# EAGLE design powerdist2 (EAGLE 6.5.0)
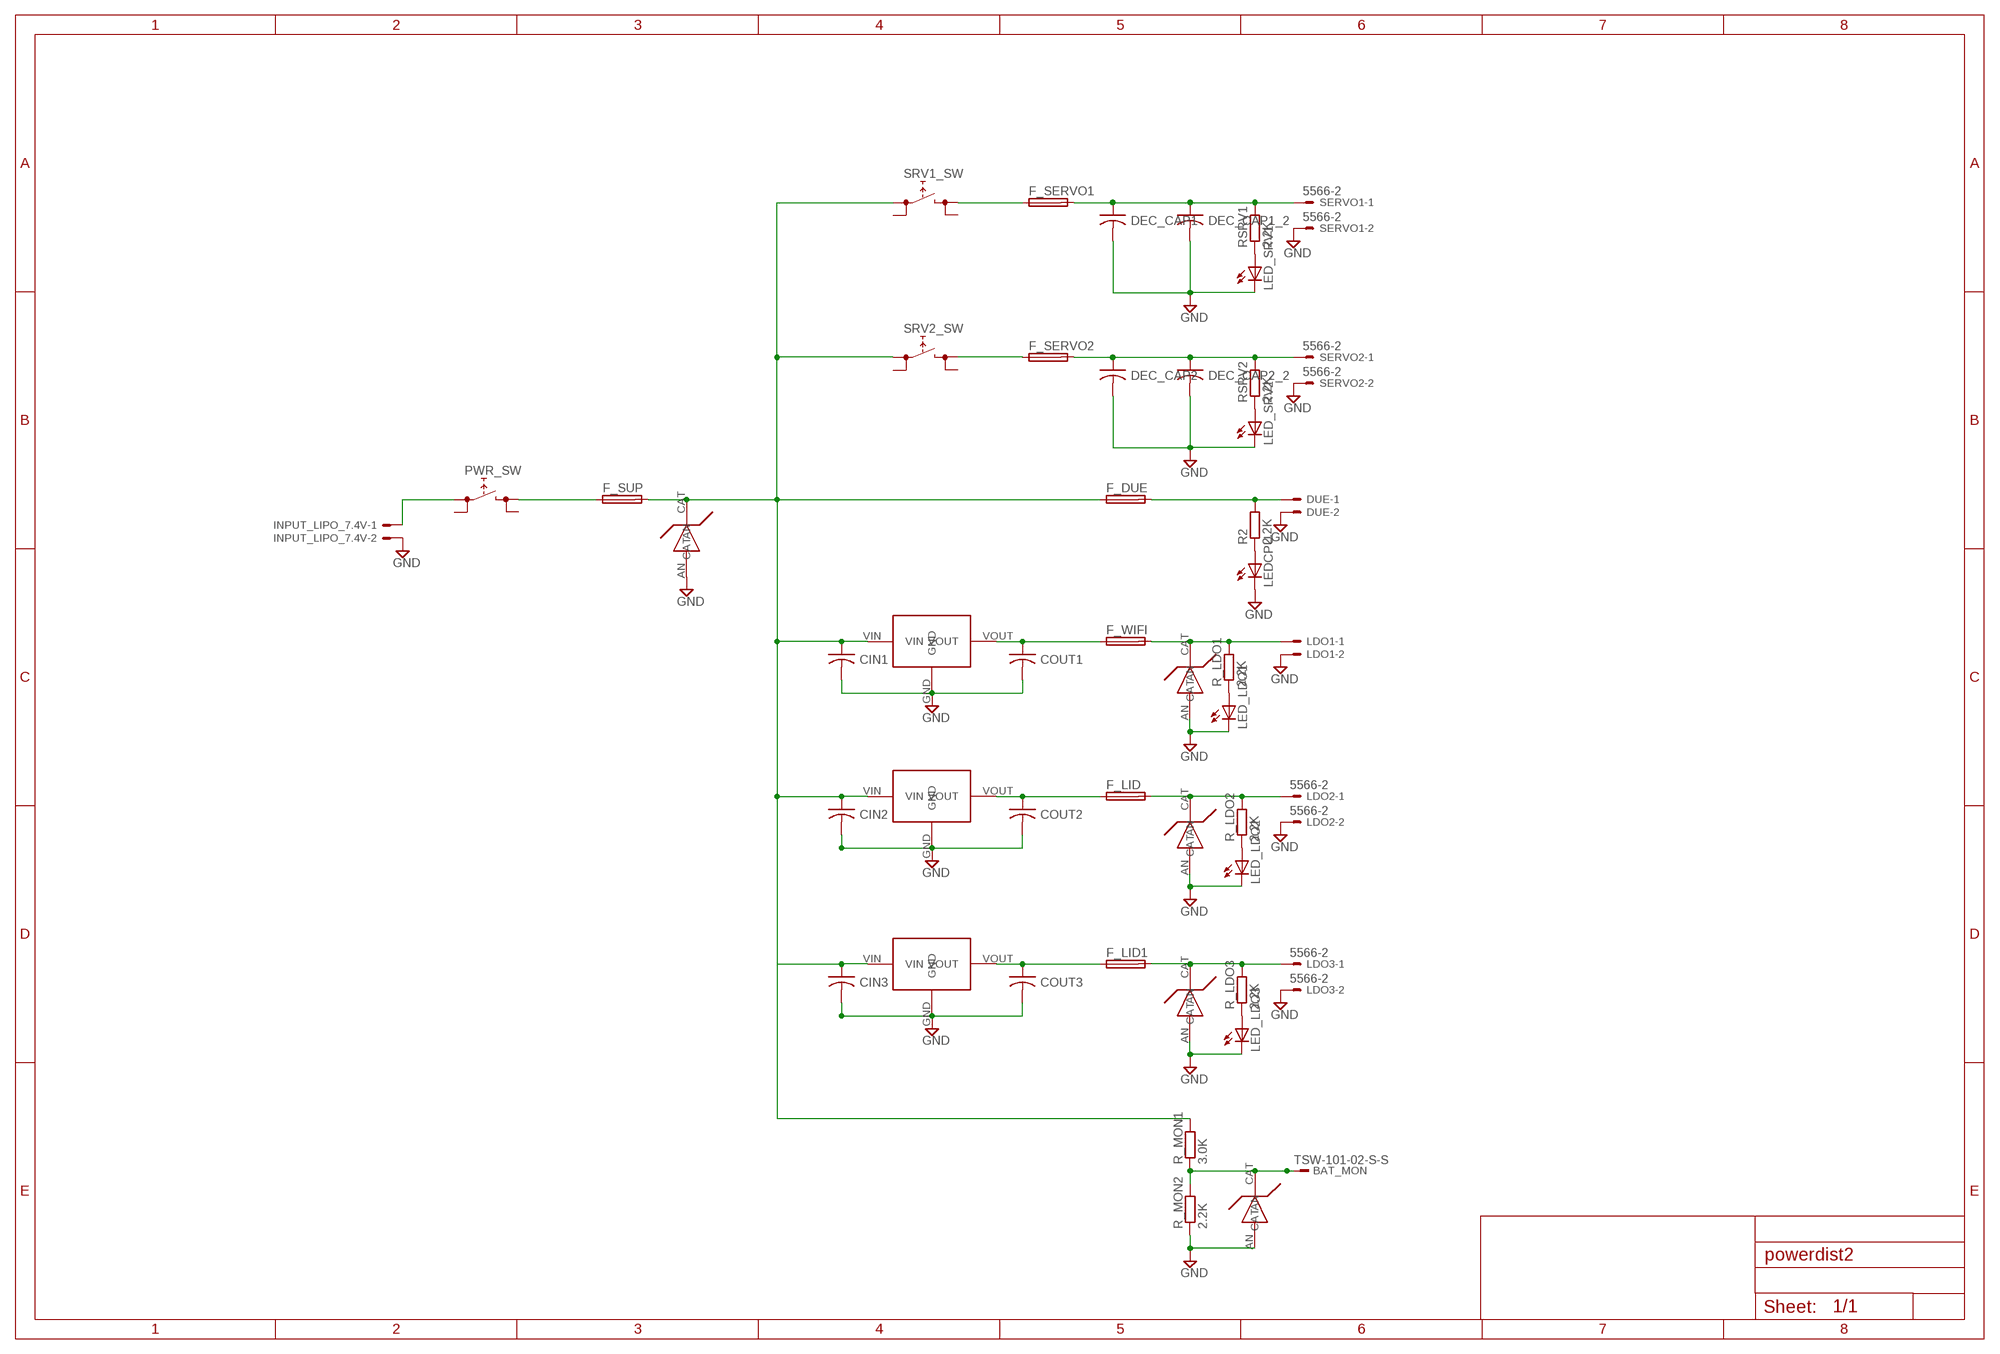
[diagram p0: schematic, sheet 1]

## Parts
BAT_MON  TSW-101-02-S-S  [TSW-101-02-S-S]
CIN1  CAPACITORTH_CAP  [C025-025X050]
CIN2  CAPACITORTH_CAP  [C025-025X050]
CIN3  CAPACITORTH_CAP  [C025-025X050]
COUT1  CAPACITORTH_CAP  [C025-025X050]
COUT2  CAPACITORTH_CAP  [C025-025X050]
COUT3  CAPACITORTH_CAP  [C025-025X050]
DEC_CAP1  CAPACITORTH_CAP  [C025-025X050]
DEC_CAP1_2  CAPACITORTH_CAP  [C025-025X050]
DEC_CAP2  CAPACITORTH_CAP  [C025-025X050]
DEC_CAP2_2  CAPACITORTH_CAP  [C025-025X050]
DUE  C-GRID-02-70553  [70553-02]
F_DUE  GSH15  [GSH15]
F_LID  GSH15  [GSH15]
F_LID1  GSH15  [GSH15]
F_SERVO1  GSH15  [GSH15]
F_SERVO2  GSH15  [GSH15]
F_SUP  GSH15  [GSH15]
F_WIFI  GSH15  [GSH15]
INPUT_LIPO_7.4V  22-23-2021  [22-23-2021]
LDO1  C-GRID-02-70553  [70553-02]
LDO2  5566-2  [5566-2]
LDO3  5566-2  [5566-2]
LED_LDO1  LEDCHIP-LED0805  [CHIP-LED0805]
LED_LDO2  LEDCHIP-LED0805  [CHIP-LED0805]
LED_LDO3  LEDCHIP-LED0805  [CHIP-LED0805]
LED_SRV1  LEDCHIP-LED0805  [CHIP-LED0805]
LED_SRV2  LEDCHIP-LED0805  [CHIP-LED0805]
LEDCPU  LEDCHIP-LED0805  [CHIP-LED0805]
LID12V1A  MIC29150/29300/29500  [MIC29150/29300/29500]
LID12V1A1  MIC29150/29300/29500  [MIC29150/29300/29500]
PWR_SW  REKN  [REKN]
R2  2.2K  R-EU_R0402  [R0402]
R_LDO1  2.2K  R-EU_R0402  [R0402]
R_LDO2  2.2K  R-EU_R0402  [R0402]
R_LDO3  2.2K  R-EU_R0402  [R0402]
R_MON1  3.0K  R-EU_R0402  [R0402]
R_MON2  2.2K  R-EU_R0402  [R0402]
RSRV1  2.2K  R-EU_R0402  [R0402]
RSRV2  2.2K  R-EU_R0402  [R0402]
SERVO1  5566-2  [5566-2]
SERVO2  5566-2  [5566-2]
SRV1_SW  REKN  [REKN]
SRV2_SW  REKN  [REKN]
TVS-MAIN  26V  TVS-DIODE-SMAJ  [TVS-SMAJ]
TVS-MAIN1  16V  TVS-DIODE-SMAJ  [TVS-SMAJ]
TVS-MAIN2  5V  TVS-DIODE-SMAJ  [TVS-SMAJ]
TVS-MAIN3  16V  TVS-DIODE-SMAJ  [TVS-SMAJ]
TVS_3.3  16V  TVS-DIODE-SMAJ  [TVS-SMAJ]
WIFI5V1A1  MIC29150/29300/29500  [MIC29150/29300/29500]

## Nets
GND: CIN1.2 CIN2.2 CIN3.2 COUT1.2 COUT2.2 COUT3.2 DEC_CAP1.2 DEC_CAP1_2.2 DEC_CAP2.2 DEC_CAP2_2.2 DUE.2 INPUT_LIPO_7.4V.2 LDO1.2 LDO2.2 LDO3.2 LED_LDO1.C LED_LDO2.C LED_LDO3.C LED_SRV1.C LED_SRV2.C LEDCPU.C LID12V1A1.GND LID12V1A.GND R_MON2.1 SERVO1.2 SERVO2.2 TVS-MAIN1.AN TVS-MAIN2.AN TVS-MAIN3.AN TVS-MAIN.AN TVS_3.3.AN WIFI5V1A1.GND
N$1: DEC_CAP2.1 DEC_CAP2_2.1 F_SERVO2.2 RSRV2.2 SERVO2.1
N$2: F_LID.2 LDO2.1 R_LDO2.2 TVS-MAIN3.CAT
N$3: F_SERVO1.1 SRV1_SW.1A
N$4: DUE.1 F_DUE.2 R2.2
N$5: LED_SRV2.A RSRV2.1
N$6: COUT1.1 F_WIFI.1 WIFI5V1A1.VOUT
N$7: F_WIFI.2 LDO1.1 R_LDO1.2 TVS-MAIN2.CAT
N$8: LEDCPU.A R2.1
N$9: COUT2.1 F_LID.1 LID12V1A.VOUT
N$10: INPUT_LIPO_7.4V.1 PWR_SW.0A
N$11: LED_LDO1.A R_LDO1.1
N$12: CIN1.1 CIN2.1 F_DUE.1 F_SUP.2 LID12V1A.VIN R_MON1.2 SRV1_SW.0A SRV2_SW.0A TVS-MAIN.CAT WIFI5V1A1.VIN
N$13: LED_LDO2.A R_LDO2.1
N$14: F_SUP.1 PWR_SW.1A
N$15: DEC_CAP1.1 DEC_CAP1_2.1 F_SERVO1.2 RSRV1.2 SERVO1.1
N$16: LED_SRV1.A RSRV1.1
N$17: F_SERVO2.1 SRV2_SW.1A
N$18: BAT_MON.1 R_MON1.1 R_MON2.2 TVS_3.3.CAT
N$19: COUT3.1 F_LID1.1 LID12V1A1.VOUT
N$20: CIN3.1 LID12V1A1.VIN
N$21: F_LID1.2 LDO3.1 R_LDO3.2 TVS-MAIN1.CAT
N$22: LED_LDO3.A R_LDO3.1
Unconnected: PWR_SW.0B PWR_SW.1B SRV1_SW.0B SRV1_SW.1B SRV2_SW.0B SRV2_SW.1B

## Library data of the parts
BAT_MON = con-samtec:TSW-101-02-S-S: THROUGH-HOLE .025" SQ POST HEADER Source: Samtec TSW.pdf; OC_FARNELL: unknown; OC_NEWARK: unknown
CIN1-CIN3 COUT1-COUT3 DEC_CAP1 DEC_CAP1_2 DEC_CAP2 DEC_CAP2_2 = TinyGadget(1):CAPACITOR
DUE LDO1 = con-molex:C-GRID-02: CONNECTOR wire to board 2.54 mm (0.100") pitch header; OC_FARNELL: unknown; OC_NEWARK: unknown
F_DUE F_LID F_LID1 F_SERVO1 F_SERVO2 F_SUP F_WIFI = fuse:GSH15: FUSE HOLDER grid 15mm, 19649 Wickmann; MPN: 64900001039; OC_FARNELL: 1271673; OC_NEWARK: 02P0318
INPUT_LIPO_7.4V = con-molex:22-23-2021: .100" (2.54mm) Center Header - 2 Pin; MF: MOLEX; MPN: 22-23-2021; OC_FARNELL: 1462926; OC_NEWARK: 25C3832
LDO2 LDO3 SERVO1 SERVO2 = con-molex:5566-2: Mini FIT connector 2 pol Source: http://www.molex.com; OC_FARNELL: 1822072; OC_NEWARK: unknown
LED_LDO1-LED_LDO3 LED_SRV1 LED_SRV2 LEDCPU = led:LED: LED OSRAM: - CHIPLED LG R971, LG N971, LY N971, LG Q971, LY Q971, LO R971, LY R971 LH N974, LH R974 LS Q976, LO Q976, LY Q976 LO Q996 - Hyper CHIPLED LW Q18S LB Q993, LB Q99A, LB R99A - SideLED LS A670, LO A670, LY A670, LG A670, LP A670 LB A673, LV A673, LT A673, LW A673 LH A674 LY A675 LS A676, LA A676, LO A676, LY A676, LW A676 LS A679, LY A679, LG A679 - Hyper Micro SIDELED® LS Y876, LA Y876, LO Y876, LY Y876 LT Y87S - SmartLED LW L88C, LW L88S LB L89C, LB L89S, LG L890 LS L89K, LO L89K, LY L89K LS L896, LA L896, LO L896, LY L896 - TOPLED LS T670, LO T670, LY T670, LG T670, LP T670 LSG T670, LSP T670, LSY T670, LOP T670, LYG T670 LG T671, LOG T671, LSG T671 LB T673, LV T673, LT T673, LW T673 LH T674 LS T676, LA T676, LO T676, LY T676, LB T676, LH T676, LSB T676, LW T676 LB T67C, LV T67C, LT T67C, LS T67K, LO T67K, LY T67K, LW E67C LS E67B, LA E67B, LO E67B, LY E67B, LB E67C, LV E67C, LT E67C LW T67C LS T679, LY T679, LG T679 LS T770, LO T770, LY T770, LG T770, LP T770 LB T773, LV T773, LT T773, LW T773 LH T774 LS E675, LA E675, LY E675, LS T675 LS T776, LA T776, LO T776, LY T776, LB T776 LHGB T686 LT T68C, LB T68C - Hyper Mini TOPLED® LB M676 - Mini TOPLED Santana® LG M470 LS M47K, LO M47K, LY M47K Source: http://www.osram.convergy.de LUXEON: - LUMILED® LXK2-PW12-R00, LXK2-PW12-S00, LXK2-PW14-U00, LXK2-PW14-V00 LXK2-PM12-R00, LXK2-PM12-S00, LXK2-PM14-U00 LXK2-PE12-Q00, LXK2-PE12-R00, LXK2-PE12-S00, LXK2-PE14-T00, LXK2-PE14-U00 LXK2-PB12-K00, LXK2-PB12-L00, LXK2-PB12-M00, LXK2-PB14-N00, LXK2-PB14-P00, LXK2-PB14-Q00 LXK2-PR12-L00, LXK2-PR12-M00, LXK2-PR14-Q00, LXK2-PR14-R00 LXK2-PD12-Q00, LXK2-PD12-R00, LXK2-PD12-S00 LXK2-PH12-R00, LXK2-PH12-S00 LXK2-PL12-P00, LXK2-PL12-Q00, LXK2-PL12-R00 Source: www.luxeon.com KINGBRIGHT: KA-3528ASYC Source: www.kingbright.com
LID12V1A LID12V1A1 WIFI5V1A1 = Micrel-Voltage-Regulator:MIC29150/29300/29500
PWR_SW SRV1_SW SRV2_SW = switch:REKN: PUSH SWITCH ITT-Cannon-Cannon
R2 R_LDO1-R_LDO3 R_MON1 R_MON2 RSRV1 RSRV2 = resistor:R-EU_: RESISTOR, European symbol
TVS-MAIN TVS-MAIN1-TVS-MAIN3 TVS_3.3 = Micrel-Voltage-Regulator:TVS-DIODE-SMAJ: TVS Diode SMAJ Series

## Board
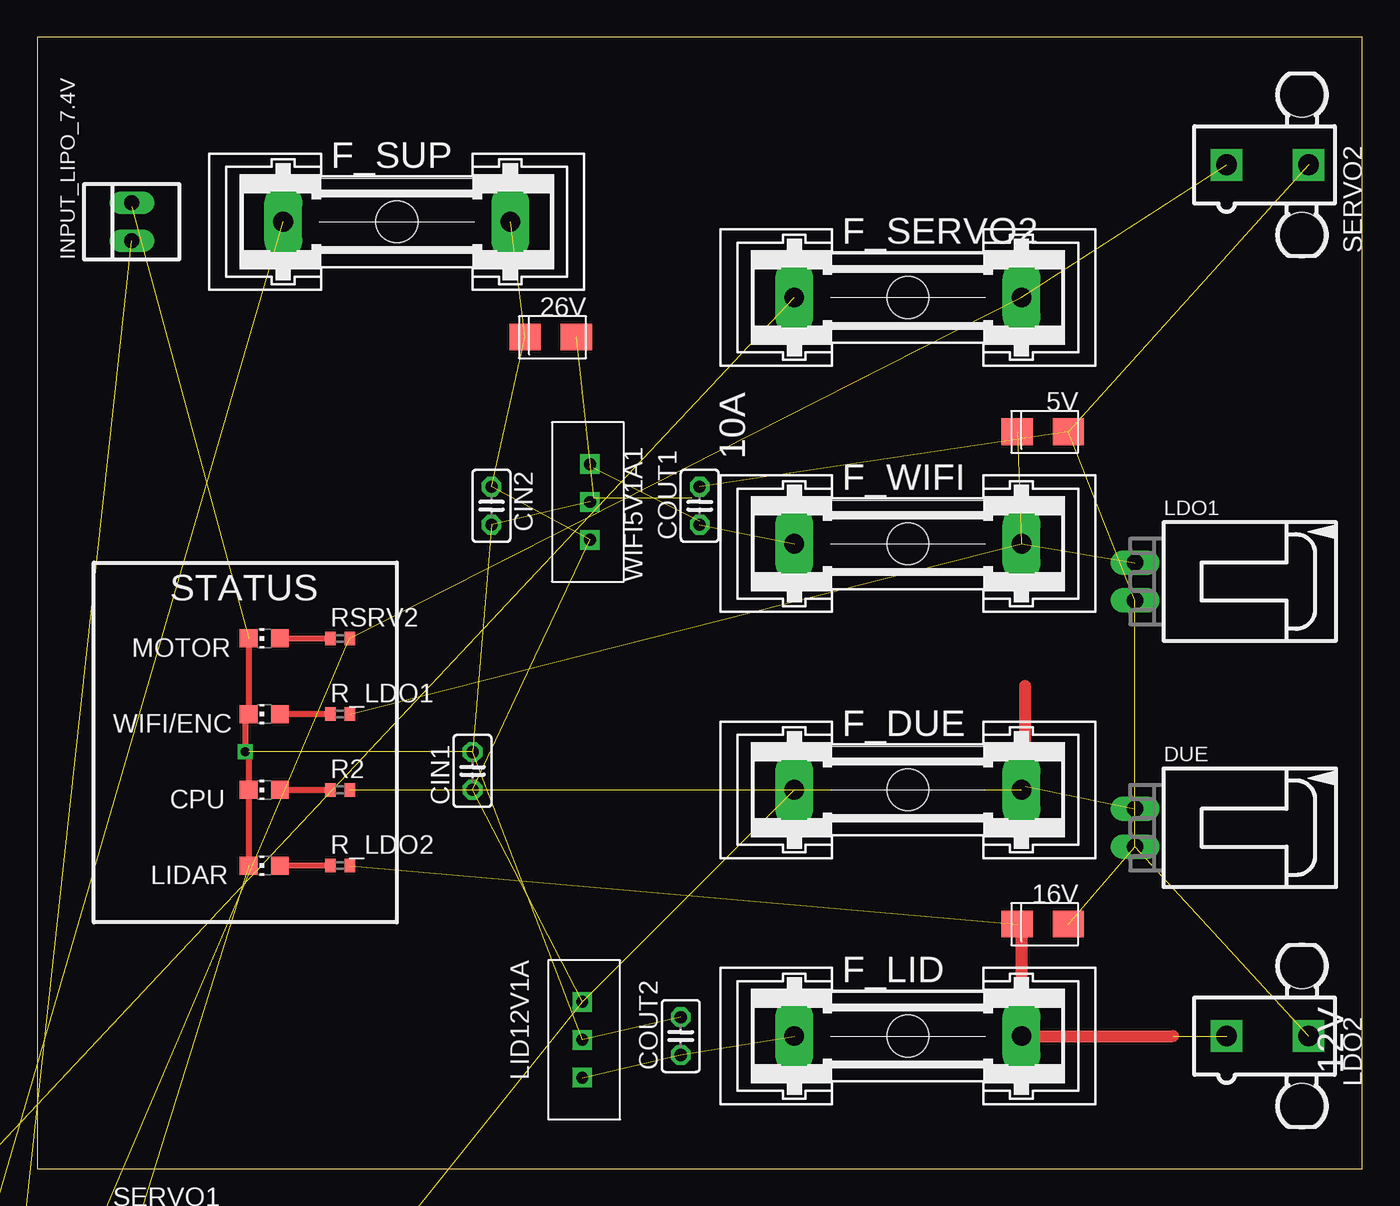
[diagram p1: board, top side]
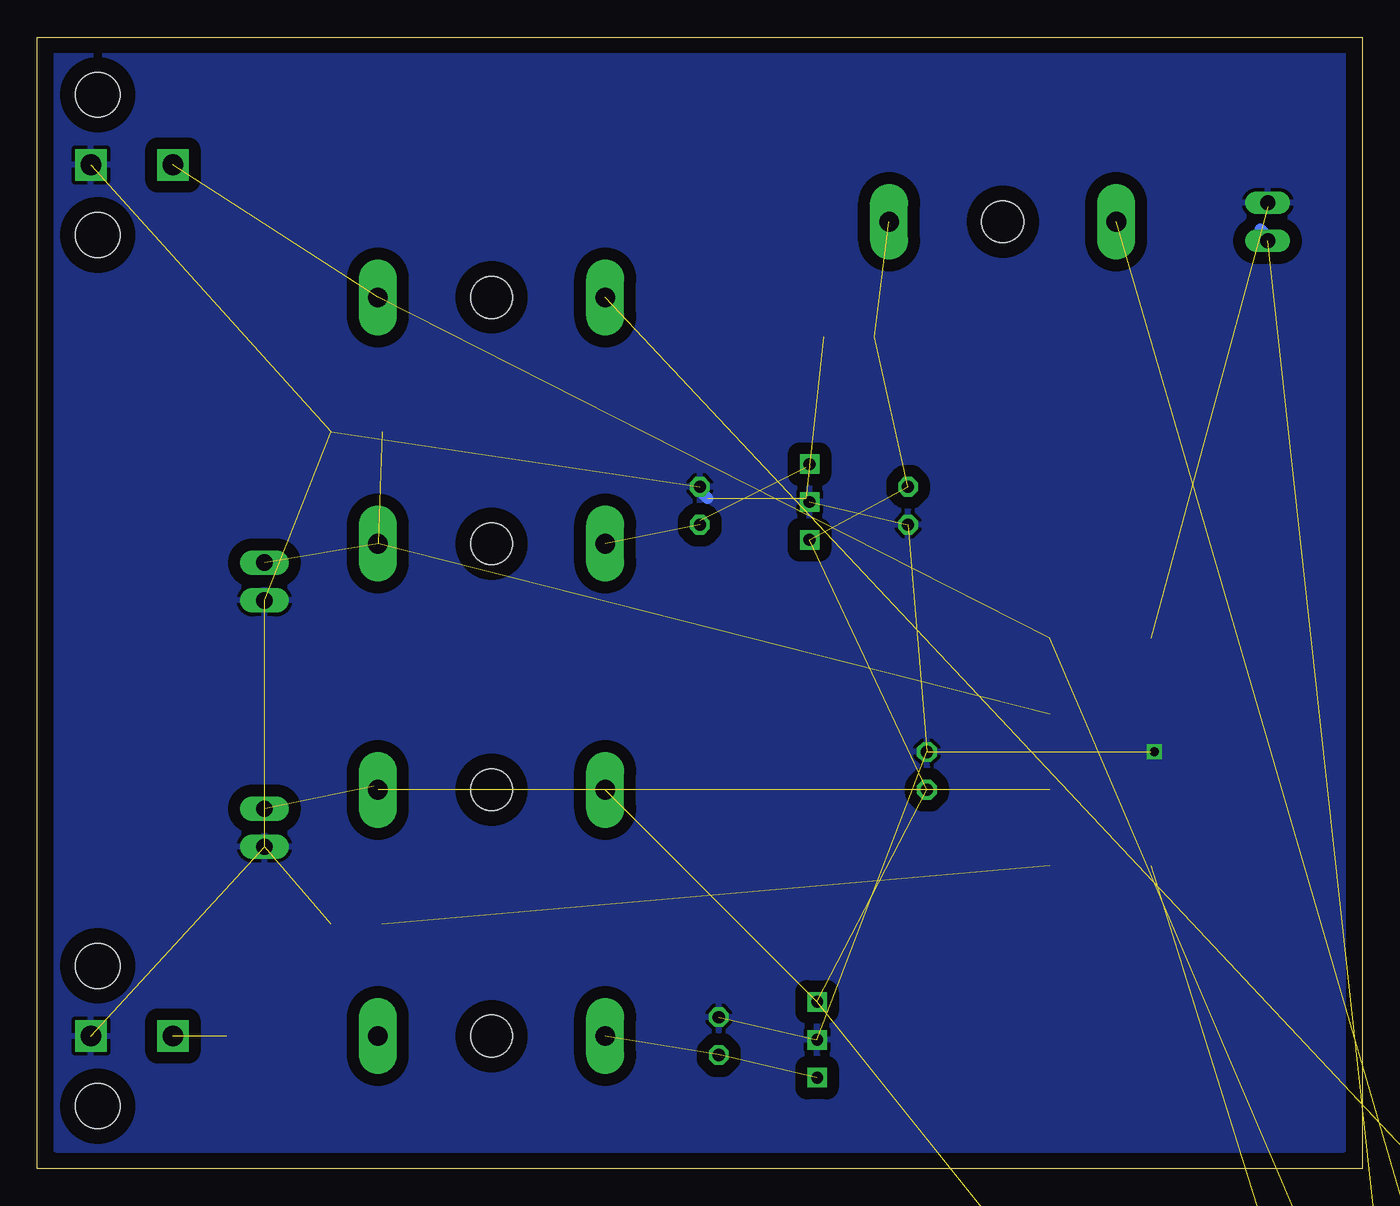
[diagram p2: board, bottom side, seen from below]

Size 88.89 x 75.87 mm. Coordinates in mm from the lower left corner, seen from the top.
Outline: 88.89,0 88.89,75.87 0,75.87 0,0 88.89,0
Copper layers (1*16): Top 0.035mm / dielectric 1.5mm / Bottom 0.035mm
Design rules "default *": minimum track width 30mil, minimum drill 24mil, track to track 8mil, track to pad 8mil, pad to pad 8mil, via to via 8mil, smd to smd 8mil, copper to edge 40mil, drill to drill 8mil, minimum pad ring 10mil, minimum via ring 8mil, stop-mask expansion 4mil, vias tented up to drill 0mil, thermal gap 10mil

### Footprints (pad centres in the part's own frame; a part is rotated, then mirrored left to right if it is on the bottom)
TSW-101-02-S-S = drill 1 pad 1.5 octagon: 1 0,0
C025-025X050 = drill 0.813 octagon: 1 -1.27,0; 2 1.27,0
70553-02 = drill 1.092 long: 1 -1.27,-7.62; 2 1.27,-7.62
GSH15 = drill 1.321 pad 2.54 long: 1 -7.62,0; 2 7.62,0 | hole 2.794: 0,0
22-23-2021 = drill 1 long: 1 -1.27,0; 2 1.27,0
5566-2 = drill 1.4 square: 1 0,-2.75; 2 0,2.75 | hole 3: 4.7,2.29; -4.7,2.29
CHIP-LED0805 = smd 1.2 x 1.2: A 0,-1.05; C 0,1.05
MIC29150/29300/29500 = drill 0.8 square: GND 5.334,2.286; VIN 2.794,2.286; VOUT 7.874,2.286
REKN = drill 0.9 long: 0A 5.08,5.08; 0B 5.08,-5.08; 1A 0,5.08; 1B 0,-5.08; A -5.08,5.08; B -5.08,-5.08 | hole 1.1: -5.08,0; 5.08,0
R0402 = smd 0.7 x 0.9: 1 -0.65,0; 2 0.65,0
TVS-SMAJ = smd 2.1 x 1.8: AN 0.66,1.38; CAT 4.1,1.38

### Placement (x,y rotation side)
BAT_MON  -19.06,-53.34 0 top  (outside the outline)
CIN1  29.2,26.67 90 top
CIN2  30.47,44.45 270 top
CIN3  -49.54,-114.3 0 top  (outside the outline)
COUT1  44.44,44.45 90 top
COUT2  43.17,8.89 90 top
COUT3  -49.54,-121.92 0 top  (outside the outline)
DEC_CAP1  -11.44,-35.56 0 top  (outside the outline)
DEC_CAP1_2  -49.54,-66.04 0 top  (outside the outline)
DEC_CAP2  -11.44,-43.18 0 top  (outside the outline)
DEC_CAP2_2  -49.54,-73.66 0 top  (outside the outline)
DUE  81.27,22.86 270 top
F_DUE  58.41,25.4 0 top
F_LID  58.41,8.89 0 top
F_LID1  -39.38,-97.79 0 top  (outside the outline)
F_SERVO1  12.69,-21.59 0 top  (outside the outline)
F_SERVO2  58.41,58.42 0 top
F_SUP  24.12,63.5 0 top
F_WIFI  58.41,41.91 0 top
INPUT_LIPO_7.4V  6.34,63.5 90 top
LDO1  81.27,39.37 270 top
LDO2  82.54,8.89 270 top
LDO3  -45.73,-83.82 0 top  (outside the outline)
LED_LDO1  15.23,30.48 90 top
LED_LDO2  15.23,20.32 90 top
LED_LDO3  -35.57,-86.36 0 top  (outside the outline)
LED_SRV1  16.5,-11.43 0 top  (outside the outline)
LED_SRV2  15.23,35.56 90 top
LEDCPU  15.23,25.4 90 top
LID12V1A  34.28,13.97 270 top
LID12V1A1  -52.08,-109.22 0 top  (outside the outline)
PWR_SW  -7.63,-24.13 0 top  (outside the outline)
R2  20.31,25.4 0 top
R_LDO1  20.31,30.48 0 top
R_LDO2  20.31,20.32 0 top
R_LDO3  -31.76,-120.65 0 top  (outside the outline)
R_MON1  -12.71,-49.53 0 top  (outside the outline)
R_MON2  -12.71,-54.61 0 top  (outside the outline)
RSRV1  2.53,-29.21 0 top  (outside the outline)
RSRV2  20.31,35.56 0 top
SERVO1  6.34,-7.62 0 top  (outside the outline)
SERVO2  82.54,67.31 270 top
SRV1_SW  -30.49,-49.53 0 top  (outside the outline)
SRV2_SW  -45.73,-49.53 0 top  (outside the outline)
TVS-MAIN  36.82,57.15 180 top
TVS-MAIN1  -26.68,-120.65 0 top  (outside the outline)
TVS-MAIN2  69.84,50.8 180 top
TVS-MAIN3  69.84,17.78 180 top
TVS_3.3  -52.08,-60.96 0 top  (outside the outline)
WIFI5V1A1  39.36,39.37 90 top

### Tracks (layer width: path | path; a pad name or v marks a point on that pad's centre or on a via)
GND  (via drill 0.6)  (28 unrouted)
  Top 0.406: LED_SRV2.C LED_LDO1.C 13.96,30.48 v13.96,27.94 14.18,27.94 LEDCPU.C LED_LDO2.C
  Top 0.762: 6.34,64.52 INPUT_LIPO_7.4V.2
  Bottom 0.762: 43.93,44.96 44.44,45.47 COUT1.2 | 37.33,44.96 WIFI5V1A1.GND
  pour Bottom (isolate 0.813): 1.26,74.93 87.62,74.93 87.62,1.27 1.26,1.27
N$1  (4 unrouted)
N$2  (2 unrouted)
  Top 0.813: 76.19,8.89 F_LID.2 66.03,16.4 TVS-MAIN3.CAT
N$3  (1 unrouted)
N$4  (2 unrouted)
  Top 0.762: 66.28,25.65 F_DUE.2
  Top 0.813: 66.28,25.65 66.28,32.37
  Bottom 0.762: 66.28,25.65 F_DUE.2
N$5
  Top 0.406: LED_SRV2.A RSRV2.1
N$6  (2 unrouted)
  Top 0.762: 37.33,46.99 WIFI5V1A1.VOUT | 44.44,43.43 COUT1.1
  Bottom 0.762: 44.44,43.43 COUT1.1
N$7  (3 unrouted)
N$8
  Top 0.406: LEDCPU.A R2.1
N$9  (2 unrouted)
N$10  (1 unrouted)
  Bottom 0.762: 6.85,62.99 6.34,62.48 INPUT_LIPO_7.4V.1
N$11
  Top 0.406: R_LDO1.1 LED_LDO1.A
N$12  (via drill 0.6)  (9 unrouted)
  Bottom 0.762: v50.54,25.65 F_DUE.1
N$13
  Top 0.406: R_LDO2.1 LED_LDO2.A
N$14  (1 unrouted)
N$15  (4 unrouted)
N$16  (1 unrouted)
N$17  (1 unrouted)
N$18  (3 unrouted)
N$19  (2 unrouted)
N$20  (1 unrouted)
N$21  (3 unrouted)
N$22  (1 unrouted)

### Text on the board
tPlace: 10A | 12V
tNames: STATUS | MOTOR | WIFI/ENC | CPU | LIDAR